# EAGLE schematic cameras (EAGLE 6.1)
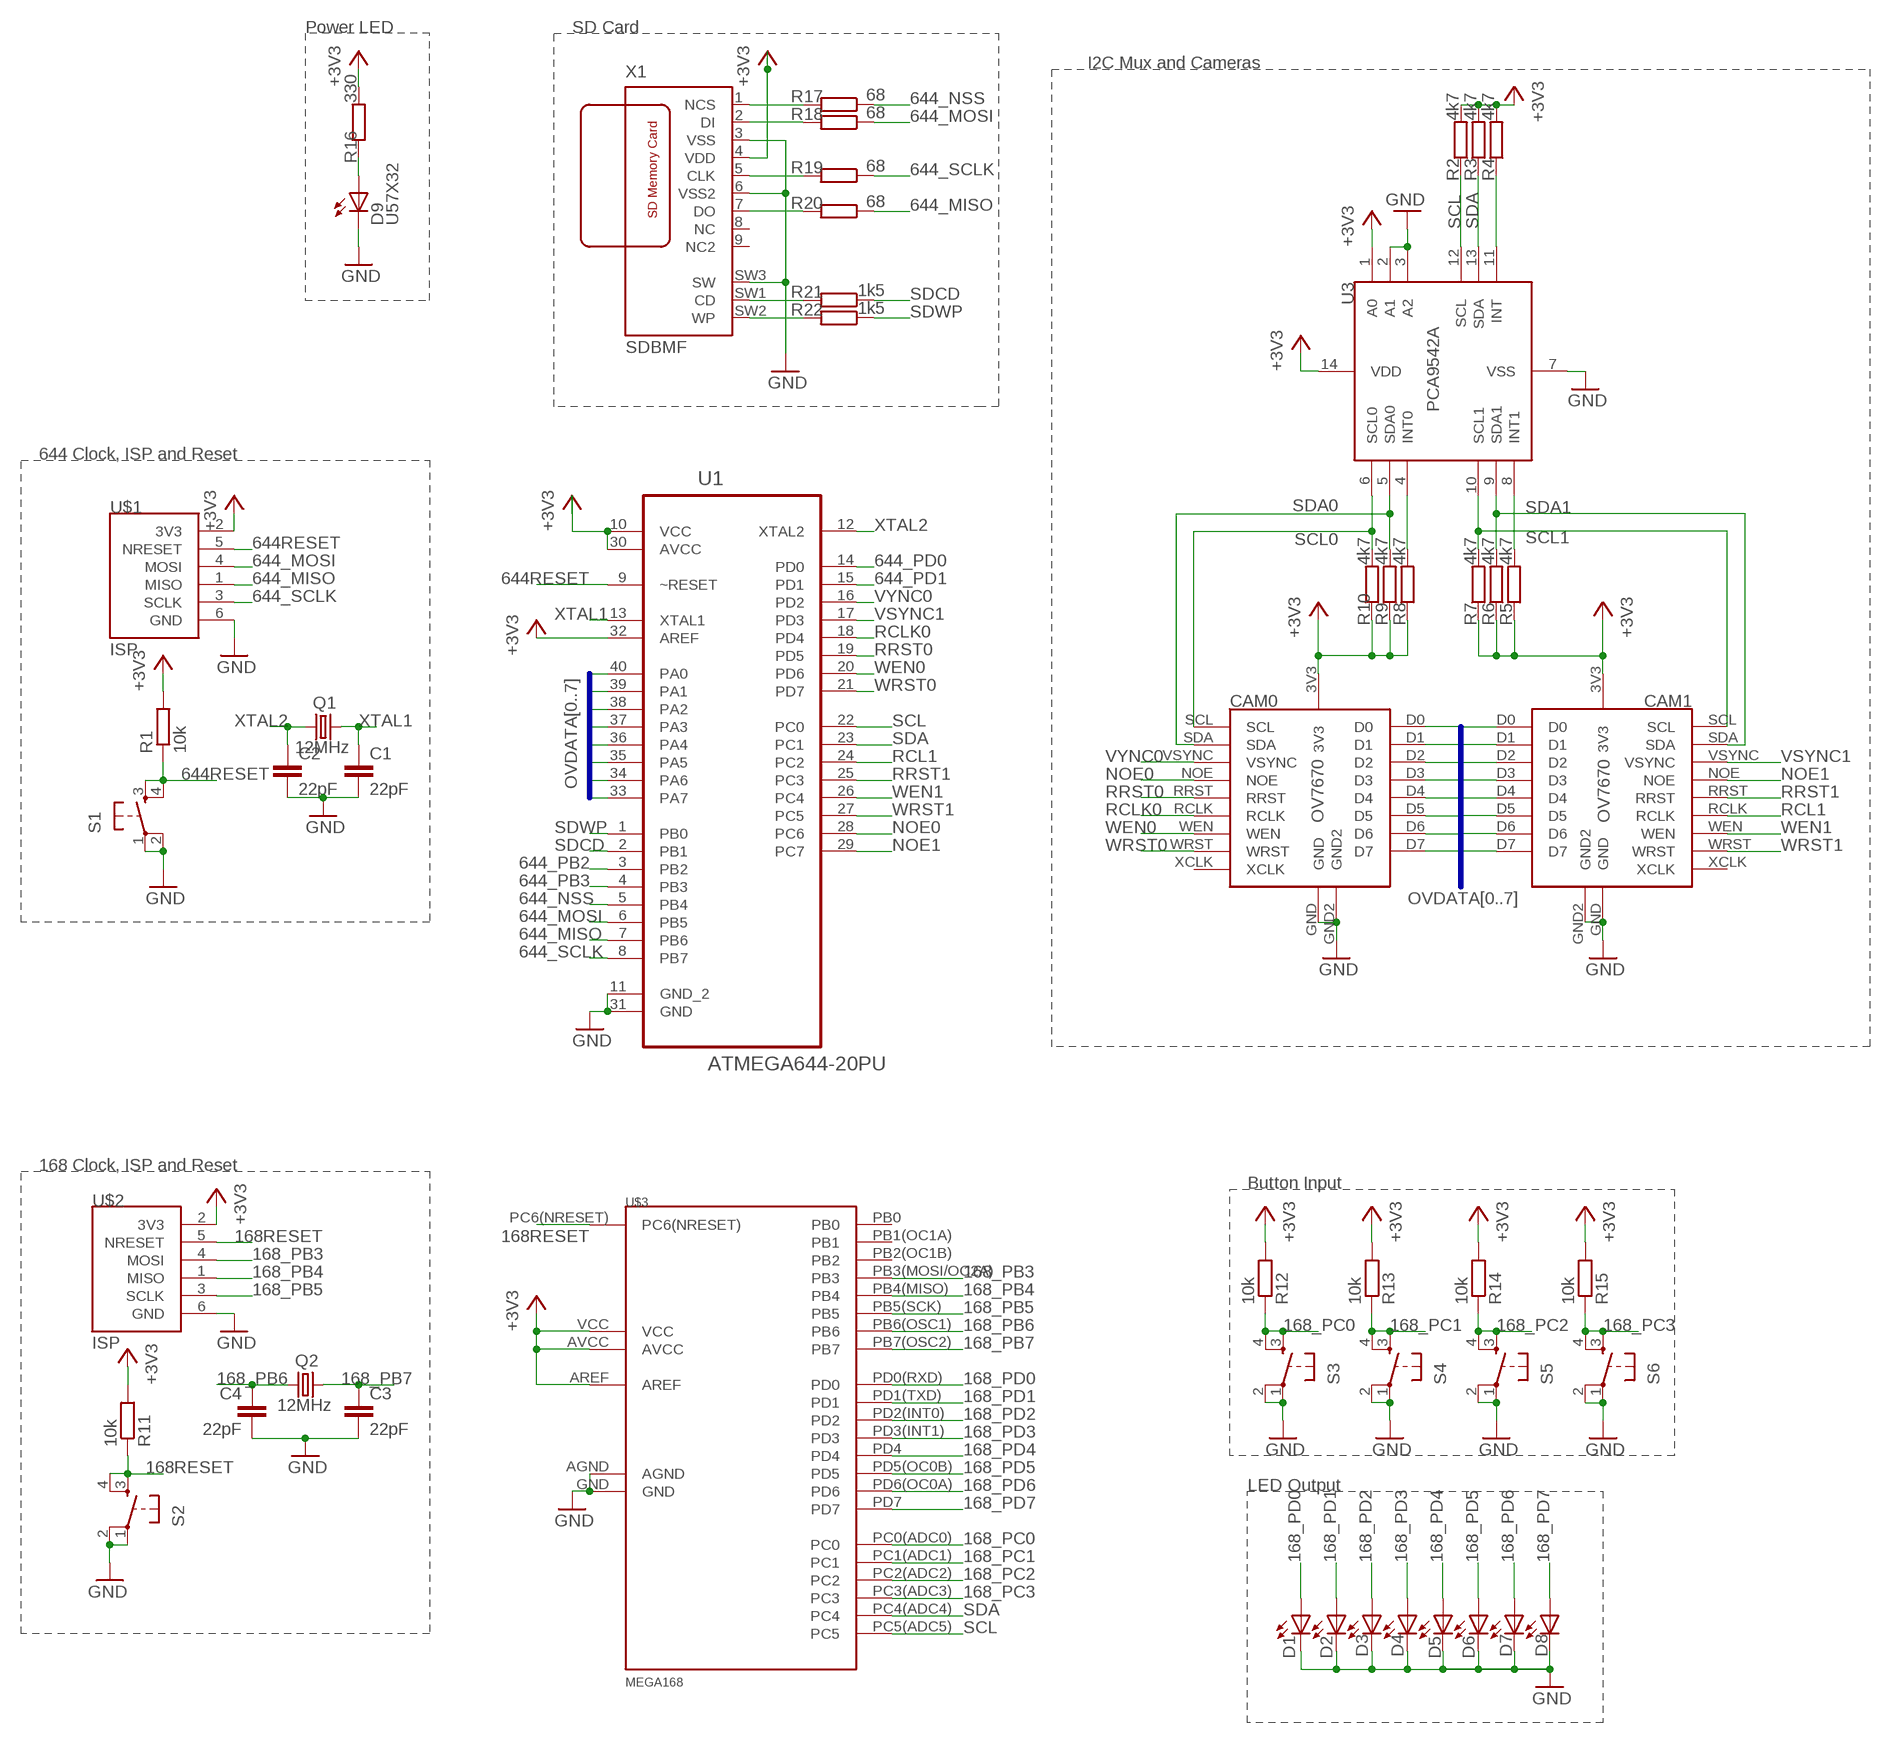
[diagram p0: schematic, sheet 1]

## Parts
C1  22pF  C-EU025-040X050  [C025-040X050]
C2  22pF  C-EU025-040X050  [C025-040X050]
C3  22pF  C-EU025-040X050  [C025-040X050]
C4  22pF  C-EU025-040X050  [C025-040X050]
CAM0  OV7670  [OV7670]
CAM1  OV7670  [OV7670]
D1  U57X32  [U57X32]
D2  U57X32  [U57X32]
D3  U57X32  [U57X32]
D4  U57X32  [U57X32]
D5  U57X32  [U57X32]
D6  U57X32  [U57X32]
D7  U57X32  [U57X32]
D8  U57X32  [U57X32]
D9  U57X32  [U57X32]
Q1  12MHz  CRYSTALHC49S  [HC49/S]
Q2  12MHz  CRYSTALHC49S  [HC49/S]
R1  10k  R-EU_0204/7  [0204/7]
R2  4k7  R-EU_0204/7  [0204/7]
R3  4k7  R-EU_0204/7  [0204/7]
R4  4k7  R-EU_0204/7  [0204/7]
R5  4k7  R-EU_0204/7  [0204/7]
R6  4k7  R-EU_0204/7  [0204/7]
R7  4k7  R-EU_0204/7  [0204/7]
R8  4k7  R-EU_0204/7  [0204/7]
R9  4k7  R-EU_0204/7  [0204/7]
R10  4k7  R-EU_0204/7  [0204/7]
R11  10k  R-EU_0204/7  [0204/7]
R12  10k  R-EU_0204/7  [0204/7]
R13  10k  R-EU_0204/7  [0204/7]
R14  10k  R-EU_0204/7  [0204/7]
R15  10k  R-EU_0204/7  [0204/7]
R16  330  R-EU_0204/7  [0204/7]
R17  68  R-EU_0204/7  [0204/7]
R18  68  R-EU_0204/7  [0204/7]
R19  68  R-EU_0204/7  [0204/7]
R20  68  R-EU_0204/7  [0204/7]
R21  1k5  R-EU_0204/7  [0204/7]
R22  1k5  R-EU_0204/7  [0204/7]
S1  TAC_SWITCHPTH  [TACTILE-PTH]
S2  TAC_SWITCHPTH  [TACTILE-PTH]
S3  TAC_SWITCHPTH  [TACTILE-PTH]
S4  TAC_SWITCHPTH  [TACTILE-PTH]
S5  TAC_SWITCHPTH  [TACTILE-PTH]
S6  TAC_SWITCHPTH  [TACTILE-PTH]
U1  ATMEGA644-20PU  [DIP254P1524X482-40]
U3  PCA9542A  [TSSOP14]
U$1  ISP  [DUALHEAD_TH_6]
U$2  ISP  [DUALHEAD_TH_6]
U$3  MEGA168  [MEGA168]
X1  SDBMF  [SDBMF-009XXBXX2]

## Nets
168_PB3: U$2.4(MOSI) U$3.PB3(MOSI/OC2A)(PB3)
168_PB4: U$2.1(MISO) U$3.PB4(MISO)(PB4)
168_PB5: U$2.3(SCLK) U$3.PB5(SCK)(PB5)
168_PB6: C4.1 Q2.1 U$3.PB6(OSC1)(PB6)
168_PB7: C3.1 Q2.2 U$3.PB7(OSC2)(PB7)
168_PC0: R12.1 S3.3 S3.4 U$3.PC0(ADC0)(PC0)
168_PC1: R13.1 S4.3 S4.4 U$3.PC1(ADC1)(PC1)
168_PC2: R14.1 S5.3 S5.4 U$3.PC2(ADC2)(PC2)
168_PC3: R15.1 S6.3 S6.4 U$3.PC3(ADC3)(PC3)
168_PD0: D1.A U$3.PD0(RXD)(PD0)
168_PD1: D2.A U$3.PD1(TXD)(PD1)
168_PD2: D3.A U$3.PD2(INT0)(PD2)
168_PD3: D4.A U$3.PD3(INT1)(PD3)
168_PD4: D5.A U$3.PD4
168_PD5: D6.A U$3.PD5(OC0B)(PD5)
168_PD6: D7.A U$3.PD6(OC0A)(PD6)
168_PD7: D8.A U$3.PD7
168RESET: R11.1 S2.3 S2.4 U$2.5(NRESET) U$3.PC6(NRESET)
644_MISO: R20.1 U1.7(PB6) U$1.1(MISO)
644_MOSI: R18.1 U1.6(PB5) U$1.4(MOSI)
644_NSS: R17.1 U1.5(PB4)
644_PB2: U1.3(PB2)
644_PB3: U1.4(PB3)
644_PD0: U1.14(PD0)
644_PD1: U1.15(PD1)
644_SCLK: R19.1 U1.8(PB7) U$1.3(SCLK)
644RESET: R1.1 S1.3 S1.4 U1.9(~RESET) U$1.5(NRESET)
+3V3: CAM0.3V3 CAM1.3V3 R1.2 R2.2 R3.2 R4.2 R5.1 R6.1 R7.1 R8.1 R9.1 R10.1 R11.2 R12.2 R13.2 R14.2 R15.2 R16.2 U1.10(VCC) U1.30(AVCC) U1.32(AREF) U3.1(A0) U3.14(VDD) U$1.2(3V3) U$2.2(3V3) U$3.AREF U$3.AVCC U$3.VCC X1.4(VDD)
GND: C1.2 C2.2 C3.2 C4.2 CAM0.GND CAM0.GND2 CAM1.GND CAM1.GND2 D1.K(C) D2.K(C) D3.K(C) D4.K(C) D5.K(C) D6.K(C) D7.K(C) D8.K(C) D9.K(C) S1.1 S1.2 S2.1 S2.2 S3.1 S3.2 S4.1 S4.2 S5.1 S5.2 S6.1 S6.2 U1.11(GND_2) U1.31(GND) U3.2(A1) U3.3(A2) U3.7(VSS) U$1.6(GND) U$2.6(GND) U$3.AGND U$3.GND X1.3(VSS) X1.6(VSS2) X1.SW3(SW)
N$1: R5.2 U3.8(INT1)
N$5: R8.2 U3.4(INT0)
N$8: R4.1 U3.11(INT)
N$13: R17.2 X1.1(NCS)
N$27: R18.2 X1.2(DI)
N$28: D9.A R16.1
N$29: R19.2 X1.5(CLK)
N$30: R20.2 X1.7(DO)
N$31: R21.2 X1.SW1(CD)
N$32: R22.2 X1.SW2(WP)
NOE0: CAM0.NOE U1.28(PC6)
NOE1: CAM1.NOE U1.29(PC7)
OVDATA0: CAM0.D0 CAM1.D0 U1.40(PA0)
OVDATA1: CAM0.D1 CAM1.D1 U1.39(PA1)
OVDATA2: CAM0.D2 CAM1.D2 U1.38(PA2)
OVDATA3: CAM0.D3 CAM1.D3 U1.37(PA3)
OVDATA4: CAM0.D4 CAM1.D4 U1.36(PA4)
OVDATA5: CAM0.D5 CAM1.D5 U1.35(PA5)
OVDATA6: CAM0.D6 CAM1.D6 U1.34(PA6)
OVDATA7: CAM0.D7 CAM1.D7 U1.33(PA7)
RCL1: CAM1.RCLK U1.24(PC2)
RCLK0: CAM0.RCLK U1.18(PD4)
RRST0: CAM0.RRST U1.19(PD5)
RRST1: CAM1.RRST U1.25(PC3)
SCL: R2.1 U1.22(PC0) U3.12(SCL) U$3.PC5(ADC5)(PC5)
SCL0: CAM0.SCL R10.2 U3.6(SCL0)
SCL1: CAM1.SCL R7.2 U3.10(SCL1)
SDA: R3.1 U1.23(PC1) U3.13(SDA) U$3.PC4(ADC4)(PC4)
SDA0: CAM0.SDA R9.2 U3.5(SDA0)
SDA1: CAM1.SDA R6.2 U3.9(SDA1)
SDCD: R21.1 U1.2(PB1)
SDWP: R22.1 U1.1(PB0)
VSYNC1: CAM1.VSYNC U1.17(PD3)
VYNC0: CAM0.VSYNC U1.16(PD2)
WEN0: CAM0.WEN U1.20(PD6)
WEN1: CAM1.WEN U1.26(PC4)
WRST0: CAM0.WRST U1.21(PD7)
WRST1: CAM1.WRST U1.27(PC5)
XTAL1: C1.1 Q1.2 U1.13(XTAL1)
XTAL2: C2.1 Q1.1 U1.12(XTAL2)
Unconnected: CAM0.XCLK CAM1.XCLK U$3.PB0 U$3.PB1(OC1A)(PB1) U$3.PB2(OC1B)(PB2) X1.8(NC) X1.9(NC2)

## Buses
OVDATA[0..7]

## Notes on the sheet
- Power LED | SD Card
- I2C Mux and Cameras
- 644 Clock, ISP and Reset
- 168 Clock, ISP and Reset
- Button Input
- LED Output

## Library data of the parts
C1-C4 = resistor:C-EU: CAPACITOR, European symbol
CAM0 CAM1 = seblov:OV7670
D1-D9 = led:U57X32: LED rectangle, 5.7 x 3.2 mm
Q1 Q2 = crystal:CRYSTAL: CRYSTAL; OC_FARNELL: 1667008; OC_NEWARK: unknown
R1-R22 = resistor:R-EU_: RESISTOR, European symbol
S1-S6 = SparkFun:TAC_SWITCH: Momentary Switch Button commonly used for reset or general input. Spark Fun Electronics SKU : COM-00097
U1 = Atmel_By_element14_Batch_1:ATMEGA644-20PU: 8-bit Microcontroller with 64K Bytes In-System Programmable Flash; MPN: ATMEGA644-20PU; OC_FARNELL: 1288340; OC_NEWARK: 23M5060; PACKAGE: DIP-40; SUPPLIER: Atmel
U3 = seblov:PCA9542A
U$1 U$2 = seblov:ISP
U$3 = seblov:MEGA168
X1 = seblov:SDBMF: SD MEMORY CARD PUSH-PUSH WITH CONNECTOR TYPE B (BIG SWUÌTCH #3) KINGFONT PRECISION INDUSTIAL CO., LTD Source: http://www.farnell.com/datasheets/74273.pdf Best.-Nr.: 9186174 Hersteller: MULTICOMP Herstellerbez.: SDBMF-00915B0T2